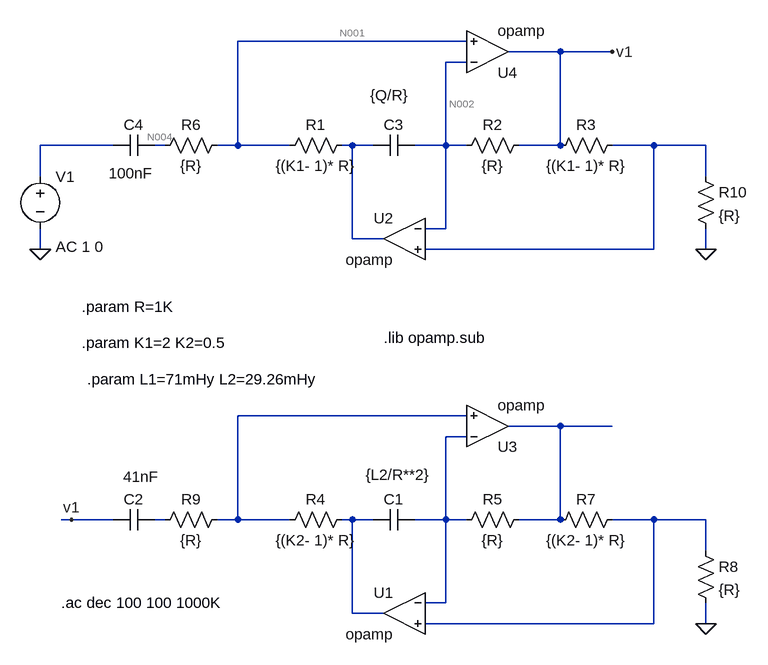
[diagram p0: schematic ts3_inductor_opamp.asc]
ts3_inductor_opamp.asc, the LTspice schematic file:
Version 4
SHEET 1 1684 964
WIRE 768 48 416 48
WIRE 912 64 832 64
WIRE 992 64 912 64
WIRE 768 80 736 80
WIRE 224 208 112 208
WIRE 304 208 288 208
WIRE 416 208 416 48
WIRE 416 208 384 208
WIRE 496 208 416 208
WIRE 592 208 576 208
WIRE 624 208 592 208
WIRE 736 208 736 80
WIRE 736 208 688 208
WIRE 768 208 736 208
WIRE 912 208 912 64
WIRE 912 208 848 208
WIRE 1056 208 992 208
WIRE 1136 208 1056 208
WIRE 112 256 112 208
WIRE 1136 256 1136 208
WIRE 736 336 736 208
WIRE 736 336 704 336
WIRE 592 352 592 208
WIRE 640 352 592 352
WIRE 112 368 112 336
WIRE 1056 368 1056 208
WIRE 1056 368 704 368
WIRE 1136 368 1136 336
WIRE 768 624 416 624
WIRE 912 640 832 640
WIRE 992 640 912 640
WIRE 768 656 736 656
WIRE 160 784 144 784
WIRE 224 784 160 784
WIRE 304 784 288 784
WIRE 416 784 416 624
WIRE 416 784 384 784
WIRE 496 784 416 784
WIRE 592 784 576 784
WIRE 624 784 592 784
WIRE 736 784 736 656
WIRE 736 784 688 784
WIRE 768 784 736 784
WIRE 912 784 912 640
WIRE 912 784 848 784
WIRE 1056 784 992 784
WIRE 1136 784 1056 784
WIRE 1136 832 1136 784
WIRE 736 912 736 784
WIRE 736 912 704 912
WIRE 592 928 592 784
WIRE 640 928 592 928
WIRE 1056 944 1056 784
WIRE 1056 944 704 944
WIRE 1136 944 1136 912
FLAG 1136 368 0
FLAG 992 64 v1
FLAG 1136 944 0
FLAG 160 784 v1
FLAG 112 368 0
SYMBOL cap 288 192 R90
WINDOW 0 0 32 VBottom 2
WINDOW 3 43 36 VTop 2
SYMATTR InstName C4
SYMATTR Value 100nF
SYMBOL res 400 192 R90
WINDOW 0 0 56 VBottom 2
WINDOW 3 32 56 VTop 2
SYMATTR InstName R6
SYMATTR Value {R}
SYMBOL res 400 768 R90
WINDOW 0 0 56 VBottom 2
WINDOW 3 32 56 VTop 2
SYMATTR InstName R9
SYMATTR Value {R}
SYMBOL cap 288 768 R90
WINDOW 0 0 32 VBottom 2
WINDOW 3 -66 21 VTop 2
SYMATTR InstName C2
SYMATTR Value 41nF
SYMBOL res 592 192 R90
WINDOW 0 0 56 VBottom 2
WINDOW 3 32 56 VTop 2
SYMATTR InstName R1
SYMATTR Value {(K1- 1)* R}
SYMBOL cap 688 192 R90
WINDOW 0 0 32 VBottom 2
WINDOW 3 -77 39 VTop 2
SYMATTR InstName C3
SYMATTR Value {Q/R}
SYMBOL res 864 192 R90
WINDOW 0 0 56 VBottom 2
WINDOW 3 32 56 VTop 2
SYMATTR InstName R2
SYMATTR Value {R}
SYMBOL res 1008 192 R90
WINDOW 0 0 56 VBottom 2
WINDOW 3 32 56 VTop 2
SYMATTR InstName R3
SYMATTR Value {(K1- 1)* R}
SYMBOL res 1120 240 R0
SYMATTR InstName R10
SYMATTR Value {R}
SYMBOL res 592 768 R90
WINDOW 0 0 56 VBottom 2
WINDOW 3 32 56 VTop 2
SYMATTR InstName R4
SYMATTR Value {(K2- 1)* R}
SYMBOL cap 688 768 R90
WINDOW 0 0 32 VBottom 2
WINDOW 3 -69 26 VTop 2
SYMATTR InstName C1
SYMATTR Value {L2/R**2}
SYMBOL res 864 768 R90
WINDOW 0 0 56 VBottom 2
WINDOW 3 32 56 VTop 2
SYMATTR InstName R5
SYMATTR Value {R}
SYMBOL res 1008 768 R90
WINDOW 0 0 56 VBottom 2
WINDOW 3 32 56 VTop 2
SYMATTR InstName R7
SYMATTR Value {(K2- 1)* R}
SYMBOL res 1120 816 R0
SYMATTR InstName R8
SYMATTR Value {R}
SYMBOL OpAmps\\opamp 800 128 M180
SYMATTR InstName U4
SYMATTR SpiceLine2 GBW=10000Meg
SYMBOL OpAmps\\opamp 672 288 M0
SYMATTR InstName U2
SYMATTR SpiceLine2 GBW=10000Meg
SYMBOL OpAmps\\opamp 672 864 M0
SYMATTR InstName U1
SYMATTR SpiceLine2 GBW=10000Meg
SYMBOL OpAmps\\opamp 800 704 M180
SYMATTR InstName U3
SYMATTR SpiceLine2 GBW=10000Meg
SYMBOL voltage 112 240 R0
WINDOW 123 24 124 Left 2
WINDOW 39 0 0 Left 0
SYMATTR InstName V1
SYMATTR Value ""
SYMATTR Value2 AC 1 0
TEXT 144 912 Left 2 !.ac dec 100 100 1000K
TEXT 176 456 Left 2 !.param R=1K
TEXT 176 512 Left 2 !.param K1=2 K2=0.5
TEXT 184 568 Left 2 !.param L1=71mHy L2=29.26mHy
TEXT 640 504 Left 2 !.lib opamp.sub

The netlist it stands for:
* ts3_inductor_opamp.asc
C4 N004 N003 100nF
R6 N001 N004 {R}
R9 N007 N010 {R}
C2 N010 v1 41nF
R1 N005 N001 {(K1- 1)* R}
C3 N002 N005 {Q/R}
R2 v1 N002 {R}
R3 N006 v1 {(K1- 1)* R}
R10 N006 0 {R}
R4 N011 N007 {(K2- 1)* R}
C1 N009 N011 {L2/R**2}
R5 N008 N009 {R}
R7 N012 N008 {(K2- 1)* R}
R8 N012 0 {R}
XU4 N002 N001 v1 opamp Aol=100K GBW=10000Meg  ; pins invin noninvin out
XU2 N002 N006 N005 opamp Aol=100K GBW=10000Meg  ; pins invin noninvin out
XU1 N009 N012 N011 opamp Aol=100K GBW=10000Meg  ; pins invin noninvin out
XU3 N009 N007 N008 opamp Aol=100K GBW=10000Meg  ; pins invin noninvin out
V1 N003 0 AC 1 0
.ac dec 100 100 1000K
.param R=1K
.param K1=2 K2=0.5
.param L1=71mHy L2=29.26mHy
.lib opamp.sub
.backanno
.end

* Results of the author's LTspice run, read from the files saved beside the schematic
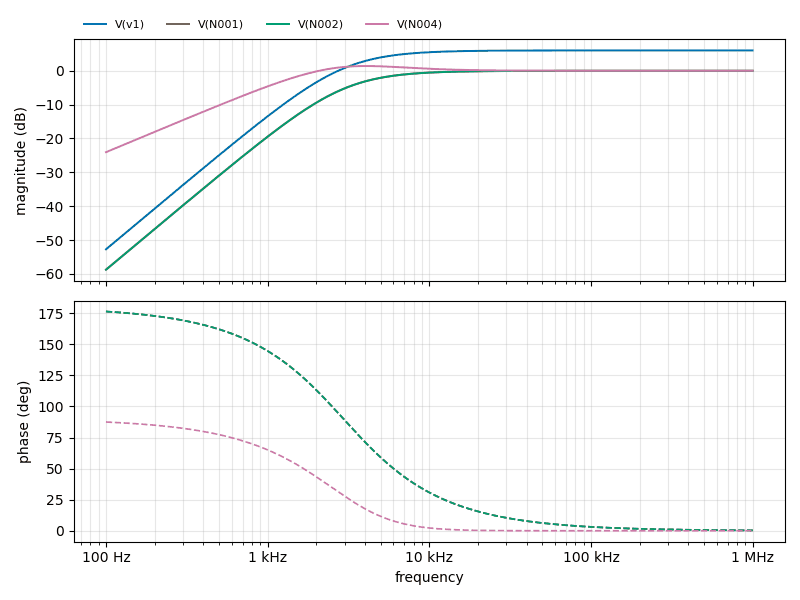
[diagram p1: AC Analysis of ts3_inductor_opamp.asc, plotted from the saved traces]
* AC Analysis, 1 run:
*   V(v1): -52.73 dB at 100 Hz, 6.02 dB at 1 MHz, peak 6.02 dB at 1 MHz, 3 dB below the peak at 4.093 kHz
*   V(N001): -58.75 dB at 100 Hz, -0.00 dB at 1 MHz, peak -0.00 dB at 1 MHz, 3 dB below the peak at 4.093 kHz
*   V(N002): -58.75 dB at 100 Hz, -0.00 dB at 1 MHz, peak -0.00 dB at 1 MHz, 3 dB below the peak at 4.093 kHz
*   V(N004): -24.04 dB at 100 Hz, 0.00 dB at 1 MHz, peak 1.41 dB at 4.074 kHz, 3 dB below the peak at 1.541 kHz